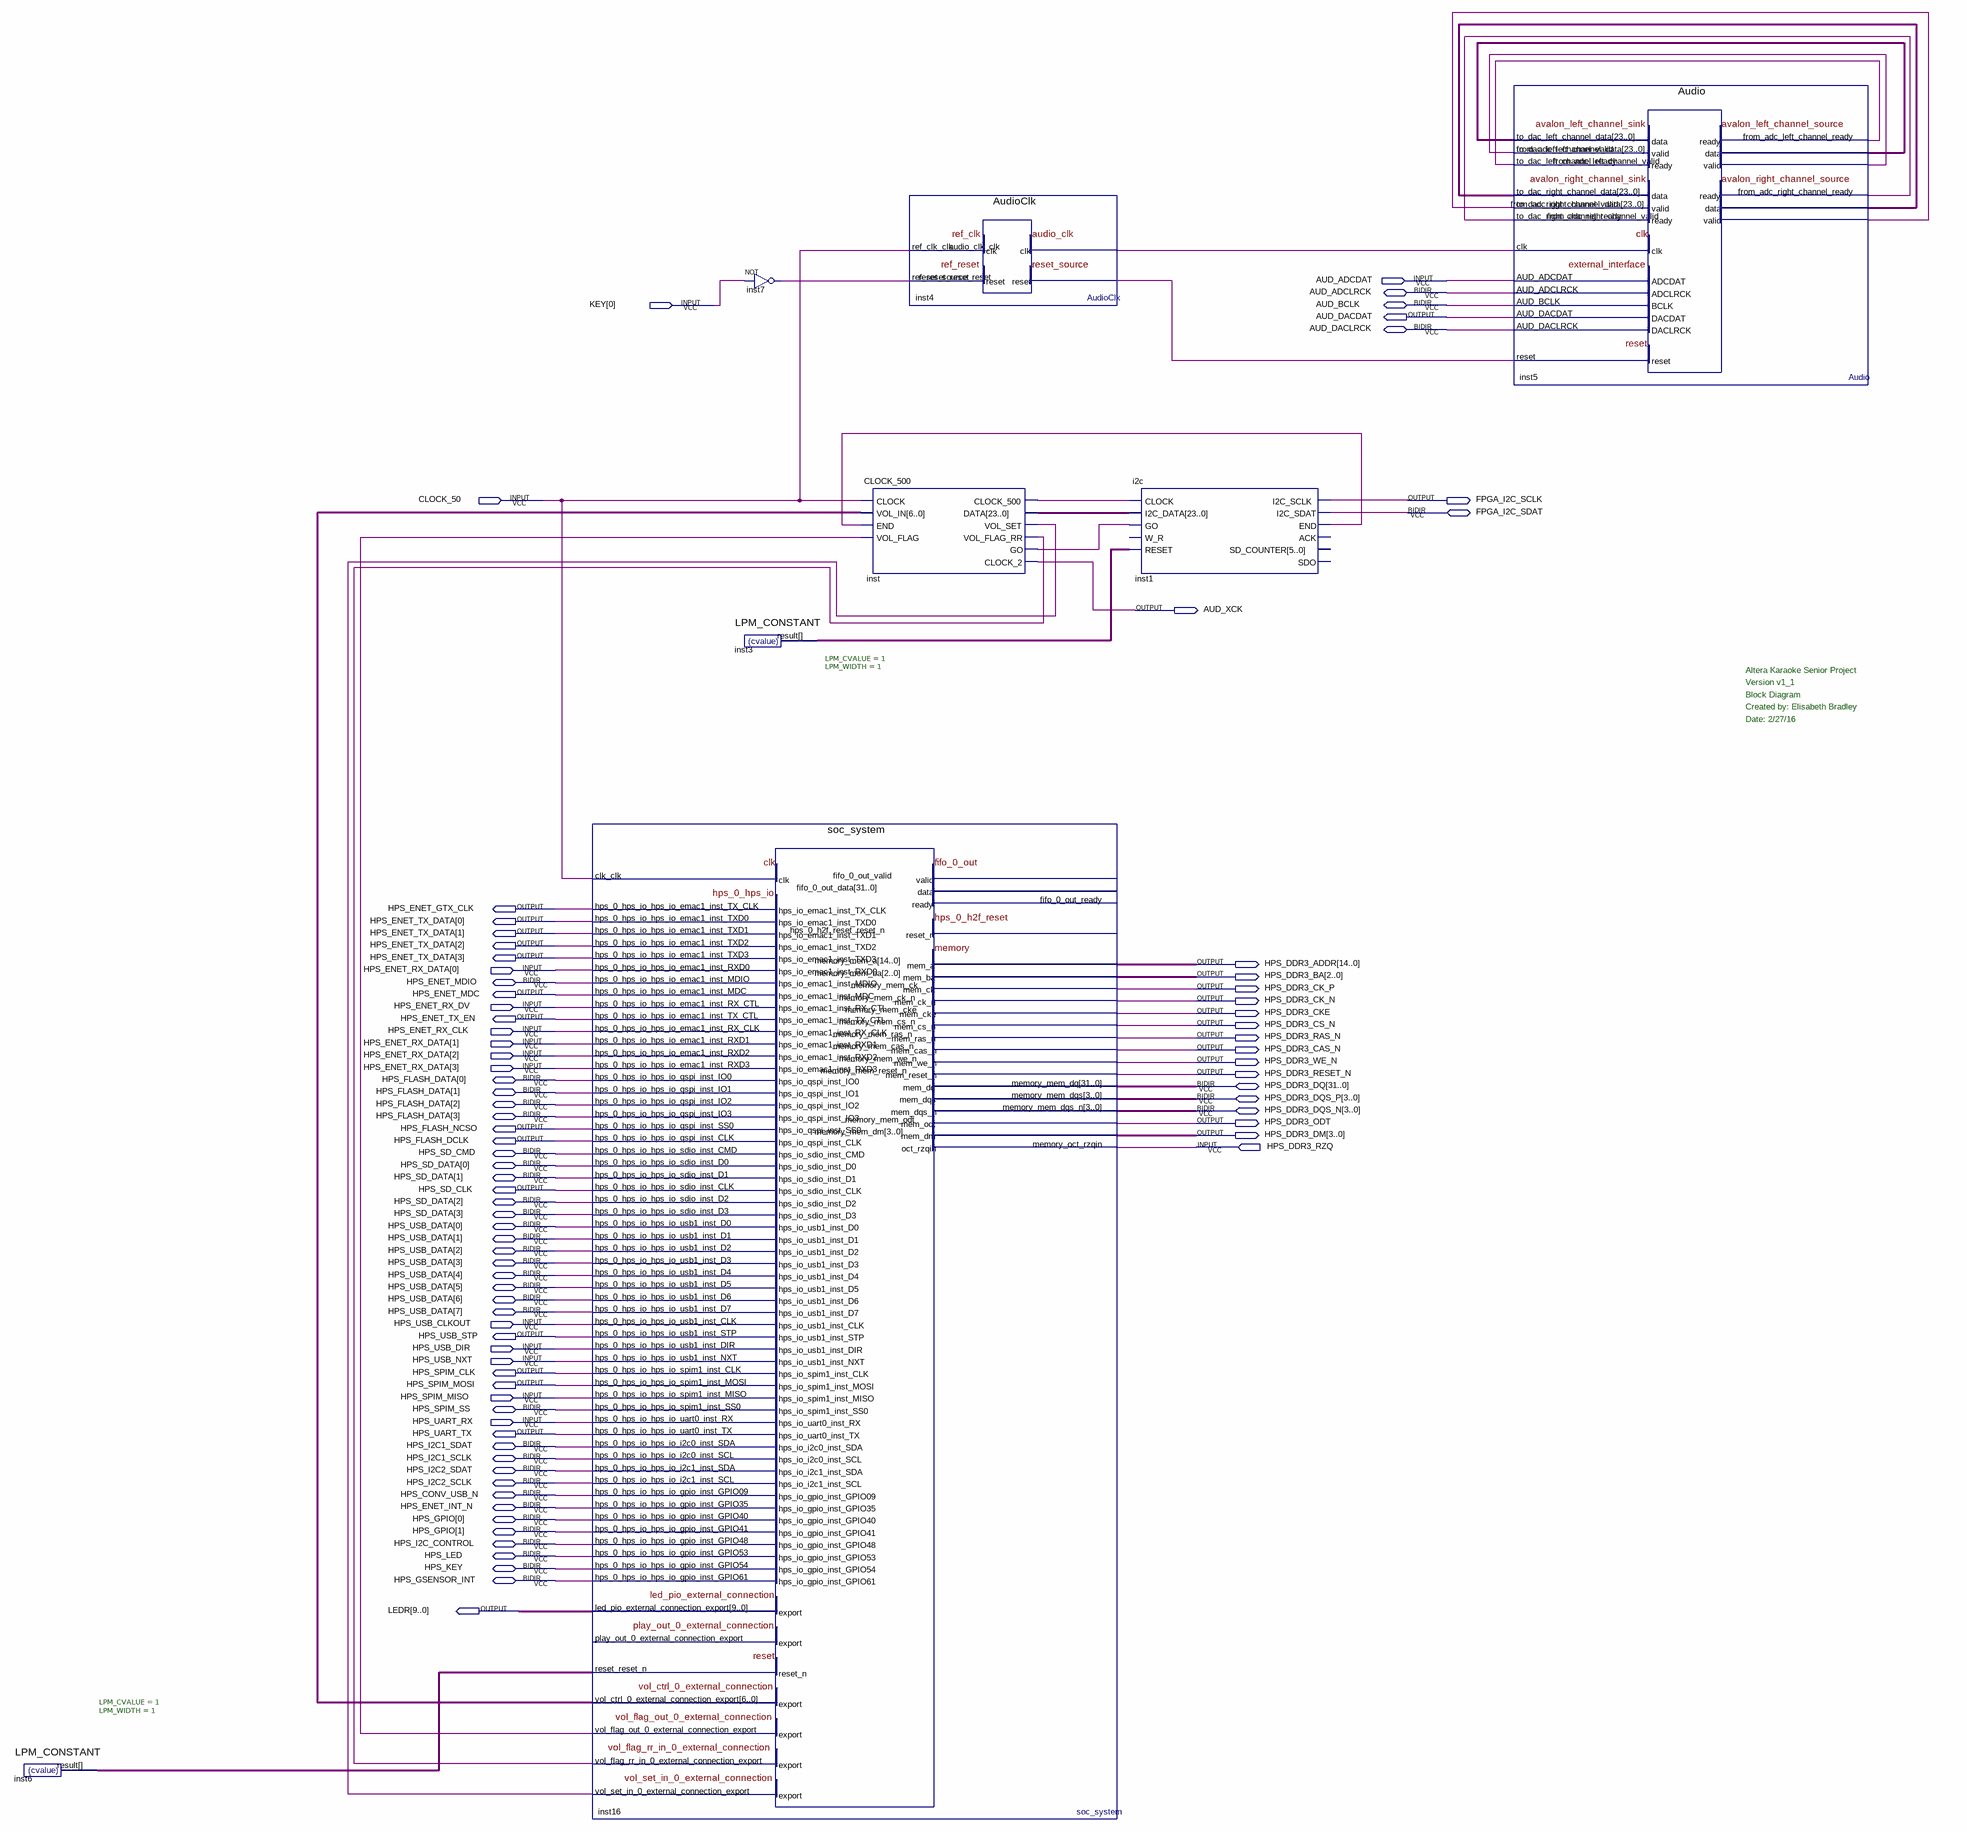
[diagram p0: schematic sheet]
// Quartus schematic Altera_Karaoke_DE1_Quartus_15_1.bdf as structural Verilog: 8 symbols, 83 pins
module Altera_Karaoke_DE1_Quartus_15_1 (
  input  AUD_ADCDAT,
  input  [0:0] KEY,
  input  CLOCK_50,
  input  [3:0] HPS_ENET_RX_DATA,
  input  HPS_ENET_RX_DV,
  input  HPS_ENET_RX_CLK,
  input  HPS_DDR3_RZQ,
  input  HPS_USB_CLKOUT,
  input  HPS_USB_DIR,
  input  HPS_USB_NXT,
  input  HPS_SPIM_MISO,
  input  HPS_UART_RX,
  inout  AUD_ADCLRCK,
  inout  AUD_BCLK,
  inout  AUD_DACLRCK,
  inout  FPGA_I2C_SDAT,
  inout  HPS_ENET_MDIO,
  inout  [3:0] HPS_FLASH_DATA,
  inout  [31:0] HPS_DDR3_DQ,
  inout  [3:0] HPS_DDR3_DQS_P,
  inout  [3:0] HPS_DDR3_DQS_N,
  inout  HPS_SD_CMD,
  inout  [3:0] HPS_SD_DATA,
  inout  [7:0] HPS_USB_DATA,
  inout  HPS_SPIM_SS,
  inout  HPS_I2C1_SDAT,
  inout  HPS_I2C1_SCLK,
  inout  HPS_I2C2_SDAT,
  inout  HPS_I2C2_SCLK,
  inout  HPS_CONV_USB_N,
  inout  HPS_ENET_INT_N,
  inout  [1:0] HPS_GPIO,
  inout  HPS_I2C_CONTROL,
  inout  HPS_LED,
  inout  HPS_KEY,
  inout  HPS_GSENSOR_INT,
  output AUD_DACDAT,
  output FPGA_I2C_SCLK,
  output AUD_XCK,
  output HPS_ENET_GTX_CLK,
  output [3:0] HPS_ENET_TX_DATA,
  output [14:0] HPS_DDR3_ADDR,
  output [2:0] HPS_DDR3_BA,
  output HPS_DDR3_CK_P,
  output HPS_ENET_MDC,
  output HPS_DDR3_CK_N,
  output HPS_DDR3_CKE,
  output HPS_ENET_TX_EN,
  output HPS_DDR3_CS_N,
  output HPS_DDR3_RAS_N,
  output HPS_DDR3_CAS_N,
  output HPS_DDR3_WE_N,
  output HPS_DDR3_RESET_N,
  output HPS_DDR3_ODT,
  output HPS_FLASH_NCSO,
  output [3:0] HPS_DDR3_DM,
  output HPS_FLASH_DCLK,
  output HPS_SD_CLK,
  output HPS_USB_STP,
  output HPS_SPIM_CLK,
  output HPS_SPIM_MOSI,
  output HPS_UART_TX,
  output [9:0] LEDR
);

  wire inst1_end, inst3_result, inst4_audio_clk_clk, inst4_reset_source_reset,
       inst5_from_adc_left_channel_valid, inst5_from_adc_right_channel_valid,
       inst5_to_dac_left_channel_ready, inst5_to_dac_right_channel_ready, inst6_result, inst7_out,
       inst16_vol_flag_out_0_external_connection_export, inst_clock_500, inst_go, inst_vol_flag_rr,
       inst_vol_set;
  wire [6:0] inst16_vol_ctrl_0_external_connection_export;
  wire [23:0] inst5_from_adc_left_channel_data, inst5_from_adc_right_channel_data, inst_data;

  LPM_CONSTANT #(.LPM_CVALUE(1), .LPM_WIDTH(1)) inst6 (.result(inst6_result));
  soc_system inst16 (
    .clk_clk(CLOCK_50), .hps_0_hps_io_hps_io_emac1_inst_RXD0(HPS_ENET_RX_DATA[0]),
    .hps_0_hps_io_hps_io_emac1_inst_RX_CTL(HPS_ENET_RX_DV),
    .hps_0_hps_io_hps_io_emac1_inst_RX_CLK(HPS_ENET_RX_CLK),
    .hps_0_hps_io_hps_io_emac1_inst_RXD1(HPS_ENET_RX_DATA[1]),
    .hps_0_hps_io_hps_io_emac1_inst_RXD2(HPS_ENET_RX_DATA[2]),
    .hps_0_hps_io_hps_io_emac1_inst_RXD3(HPS_ENET_RX_DATA[3]),
    .hps_0_hps_io_hps_io_usb1_inst_CLK(HPS_USB_CLKOUT), .hps_0_hps_io_hps_io_usb1_inst_DIR(HPS_USB_DIR),
    .hps_0_hps_io_hps_io_usb1_inst_NXT(HPS_USB_NXT), .hps_0_hps_io_hps_io_spim1_inst_MISO(HPS_SPIM_MISO),
    .hps_0_hps_io_hps_io_uart0_inst_RX(HPS_UART_RX), .memory_oct_rzqin(HPS_DDR3_RZQ),
    .reset_reset_n(inst6_result), .vol_flag_rr_in_0_external_connection_export(inst_vol_flag_rr),
    .vol_set_in_0_external_connection_export(inst_vol_set),
    .hps_0_hps_io_hps_io_emac1_inst_TX_CLK(HPS_ENET_GTX_CLK),
    .hps_0_hps_io_hps_io_emac1_inst_TXD0(HPS_ENET_TX_DATA[0]),
    .hps_0_hps_io_hps_io_emac1_inst_TXD1(HPS_ENET_TX_DATA[1]),
    .hps_0_hps_io_hps_io_emac1_inst_TXD2(HPS_ENET_TX_DATA[2]),
    .hps_0_hps_io_hps_io_emac1_inst_TXD3(HPS_ENET_TX_DATA[3]),
    .hps_0_hps_io_hps_io_emac1_inst_MDC(HPS_ENET_MDC),
    .hps_0_hps_io_hps_io_emac1_inst_TX_CTL(HPS_ENET_TX_EN),
    .hps_0_hps_io_hps_io_qspi_inst_SS0(HPS_FLASH_NCSO), .hps_0_hps_io_hps_io_qspi_inst_CLK(HPS_FLASH_DCLK),
    .hps_0_hps_io_hps_io_sdio_inst_CLK(HPS_SD_CLK), .hps_0_hps_io_hps_io_usb1_inst_STP(HPS_USB_STP),
    .hps_0_hps_io_hps_io_spim1_inst_CLK(HPS_SPIM_CLK), .hps_0_hps_io_hps_io_spim1_inst_MOSI(HPS_SPIM_MOSI),
    .hps_0_hps_io_hps_io_spim1_inst_SS0(HPS_SPIM_SS), .hps_0_hps_io_hps_io_uart0_inst_TX(HPS_UART_TX),
    .led_pio_external_connection_export(LEDR), .memory_mem_a(HPS_DDR3_ADDR), .memory_mem_ba(HPS_DDR3_BA),
    .memory_mem_ck(HPS_DDR3_CK_P), .memory_mem_ck_n(HPS_DDR3_CK_N), .memory_mem_cke(HPS_DDR3_CKE),
    .memory_mem_cs_n(HPS_DDR3_CS_N), .memory_mem_ras_n(HPS_DDR3_RAS_N), .memory_mem_cas_n(HPS_DDR3_CAS_N),
    .memory_mem_we_n(HPS_DDR3_WE_N), .memory_mem_reset_n(HPS_DDR3_RESET_N), .memory_mem_odt(HPS_DDR3_ODT),
    .memory_mem_dm(HPS_DDR3_DM),
    .vol_ctrl_0_external_connection_export(inst16_vol_ctrl_0_external_connection_export),
    .vol_flag_out_0_external_connection_export(inst16_vol_flag_out_0_external_connection_export),
    .hps_0_hps_io_hps_io_emac1_inst_MDIO(HPS_ENET_MDIO),
    .hps_0_hps_io_hps_io_qspi_inst_IO0(HPS_FLASH_DATA[0]),
    .hps_0_hps_io_hps_io_qspi_inst_IO1(HPS_FLASH_DATA[1]),
    .hps_0_hps_io_hps_io_qspi_inst_IO2(HPS_FLASH_DATA[2]),
    .hps_0_hps_io_hps_io_qspi_inst_IO3(HPS_FLASH_DATA[3]), .hps_0_hps_io_hps_io_sdio_inst_CMD(HPS_SD_CMD),
    .hps_0_hps_io_hps_io_sdio_inst_D0(HPS_SD_DATA[0]), .hps_0_hps_io_hps_io_sdio_inst_D1(HPS_SD_DATA[1]),
    .hps_0_hps_io_hps_io_sdio_inst_D2(HPS_SD_DATA[2]), .hps_0_hps_io_hps_io_sdio_inst_D3(HPS_SD_DATA[3]),
    .hps_0_hps_io_hps_io_usb1_inst_D0(HPS_USB_DATA[0]), .hps_0_hps_io_hps_io_usb1_inst_D1(HPS_USB_DATA[1]),
    .hps_0_hps_io_hps_io_usb1_inst_D2(HPS_USB_DATA[2]), .hps_0_hps_io_hps_io_usb1_inst_D3(HPS_USB_DATA[3]),
    .hps_0_hps_io_hps_io_usb1_inst_D4(HPS_USB_DATA[4]), .hps_0_hps_io_hps_io_usb1_inst_D5(HPS_USB_DATA[5]),
    .hps_0_hps_io_hps_io_usb1_inst_D6(HPS_USB_DATA[6]), .hps_0_hps_io_hps_io_usb1_inst_D7(HPS_USB_DATA[7]),
    .hps_0_hps_io_hps_io_i2c0_inst_SDA(HPS_I2C1_SDAT), .hps_0_hps_io_hps_io_i2c0_inst_SCL(HPS_I2C1_SCLK),
    .hps_0_hps_io_hps_io_i2c1_inst_SDA(HPS_I2C2_SDAT), .hps_0_hps_io_hps_io_i2c1_inst_SCL(HPS_I2C2_SCLK),
    .hps_0_hps_io_hps_io_gpio_inst_GPIO09(HPS_CONV_USB_N),
    .hps_0_hps_io_hps_io_gpio_inst_GPIO35(HPS_ENET_INT_N),
    .hps_0_hps_io_hps_io_gpio_inst_GPIO40(HPS_GPIO[0]), .hps_0_hps_io_hps_io_gpio_inst_GPIO41(HPS_GPIO[1]),
    .hps_0_hps_io_hps_io_gpio_inst_GPIO48(HPS_I2C_CONTROL), .hps_0_hps_io_hps_io_gpio_inst_GPIO53(HPS_LED),
    .hps_0_hps_io_hps_io_gpio_inst_GPIO54(HPS_KEY), .hps_0_hps_io_hps_io_gpio_inst_GPIO61(HPS_GSENSOR_INT),
    .memory_mem_dq(HPS_DDR3_DQ), .memory_mem_dqs(HPS_DDR3_DQS_P), .memory_mem_dqs_n(HPS_DDR3_DQS_N));  // open: fifo_0_out_ready, fifo_0_out_valid, fifo_0_out_data, hps_0_h2f_reset_reset_n, play_out_0_external_connection_export
  not inst7 (inst7_out, KEY[0]);
  LPM_CONSTANT #(.LPM_CVALUE(1), .LPM_WIDTH(1)) inst3 (.result(inst3_result));
  CLOCK_500 inst (
    .CLOCK(CLOCK_50), .VOL_IN(inst16_vol_ctrl_0_external_connection_export), .END(inst1_end),
    .VOL_FLAG(inst16_vol_flag_out_0_external_connection_export), .CLOCK_500(inst_clock_500),
    .DATA(inst_data), .VOL_SET(inst_vol_set), .VOL_FLAG_RR(inst_vol_flag_rr), .GO(inst_go), .CLOCK_2(AUD_XCK));
  AudioClk inst4 (
    .ref_clk_clk(CLOCK_50), .ref_reset_reset(inst7_out), .audio_clk_clk(inst4_audio_clk_clk),
    .reset_source_reset(inst4_reset_source_reset));
  i2c inst1 (
    .CLOCK(inst_clock_500), .I2C_DATA(inst_data), .GO(inst_go), .RESET(inst3_result),
    .I2C_SCLK(FPGA_I2C_SCLK), .END(inst1_end), .I2C_SDAT(FPGA_I2C_SDAT));  // open: W_R, ACK, SD_COUNTER, SDO
  Audio inst5 (
    .to_dac_left_channel_data(inst5_from_adc_left_channel_data),
    .to_dac_left_channel_valid(inst5_from_adc_left_channel_valid),
    .from_adc_left_channel_ready(inst5_to_dac_left_channel_ready),
    .to_dac_right_channel_data(inst5_from_adc_right_channel_data),
    .to_dac_right_channel_valid(inst5_from_adc_right_channel_valid),
    .from_adc_right_channel_ready(inst5_to_dac_right_channel_ready), .clk(inst4_audio_clk_clk),
    .AUD_ADCDAT(AUD_ADCDAT), .AUD_ADCLRCK(AUD_ADCLRCK), .AUD_BCLK(AUD_BCLK), .AUD_DACLRCK(AUD_DACLRCK),
    .reset(inst4_reset_source_reset), .to_dac_left_channel_ready(inst5_to_dac_left_channel_ready),
    .from_adc_left_channel_data(inst5_from_adc_left_channel_data),
    .from_adc_left_channel_valid(inst5_from_adc_left_channel_valid),
    .to_dac_right_channel_ready(inst5_to_dac_right_channel_ready),
    .from_adc_right_channel_data(inst5_from_adc_right_channel_data),
    .from_adc_right_channel_valid(inst5_from_adc_right_channel_valid), .AUD_DACDAT(AUD_DACDAT));

  // Notes on the sheet:
  //   Altera Karaoke Senior Project
  //   Version v1_1
  //   Block Diagram
  //   Created by: Elisabeth Bradley
  //   Date: 2/27/16
endmodule
